# Altium schematic sheet CCD.SchDoc
size A4; SheetNumber: 4; SheetTotal: 5
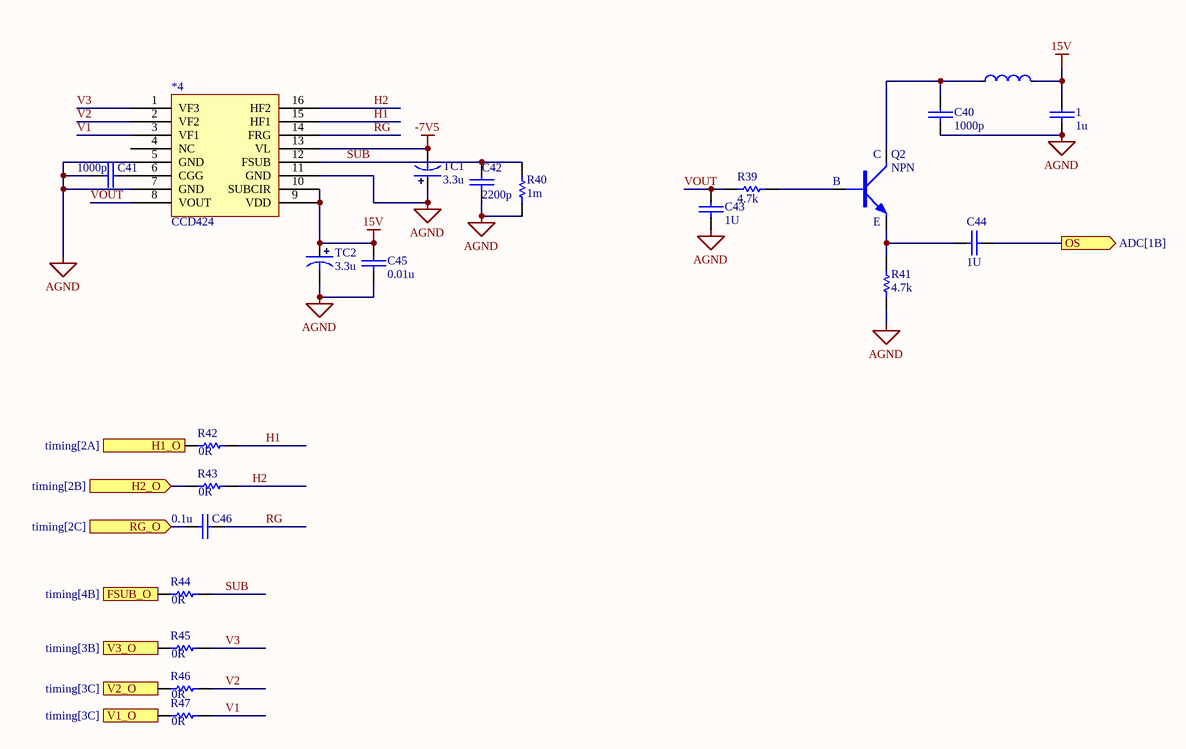
[diagram p0: CCD.SchDoc]

## Parts
1  1u  [0603C]
*4  CCD424  [CCD424]
C40  1000p  [0603C]
C41  1000p  [0603C]
C42  2200p  [0603C]
C43  1U  [0603C]
C44  1U  [0603C]
C45  0.01u  [0603C]
C46  0.1u  [0603C]
L11  GZ1608D601TF  [0603L]  (value not drawn)
Q2  NPN  [SOT23-3]
R39  4.7k  [0603R]
R40  1m  [0603R]
R41  4.7k  [0603R]
R42  0R  [0603R]
R43  0R  [0603R]
R44  0R  [0603R]
R45  0R  [0603R]
R46  0R  [0603R]
R47  0R  [0603R]
TC1  3.3u  [TAJ-A/3216]
TC2  3.3u  [TAJ-A/3216]

## Ports
FSUB_O (in, see timing[4B]), H1_O (in, see timing[2A]), H2_O (in, see timing[2B]), OS (out, see ADC[1B]), RG_O (in, see timing[2C]), V1_O (in, see timing[3C]), V2_O (in, see timing[3C]), V3_O (in, see timing[3B])

## Nets
15V: 1.2 *4.9(VDD) *4.10(SUBCIR) C45.2 L11.2 TC2.1
-7V5: *4.13(VL) TC1.2
AGND: 1.1 *4.5(GND) *4.7(GND) *4.11(GND) C40.1 C41.2 C42.1 C43.2 C45.1 R40.1 R41.1 TC1.1 TC2.2
FSUB_O: R44.2 ; port FSUB_O
H1: *4.15(HF1) R42.1
H1_O: R42.2 ; port H1_O
H2: *4.16(HF2) R43.1
H2_O: R43.2 ; port H2_O
OS: C44.1 ; port OS
RG: *4.14(FRG) C46.1
RG_O: C46.2 ; port RG_O
SUB: *4.12(FSUB) C42.2 R40.2 R44.1
V1: *4.3(VF1) R47.1
V1_O: R47.2 ; port V1_O
V2: *4.2(VF2) R46.1
V2_O: R46.2 ; port V2_O
V3: *4.1(VF3) R45.1
V3_O: R45.2 ; port V3_O
VOUT: *4.8(VOUT) C43.1 R39.2
Net*4_6: *4.6(CGG) C41.1
NetC40_2: C40.2 L11.1 Q2.3(C)
NetC44_2: C44.2 Q2.2(E) R41.2
NetQ2_1: Q2.1(B) R39.1

Not connected (* = marked no-connect by the designer): *4 4(NC)

## Library data of the parts
1 C40-C46 = CAP: 无极性电容
L11 = FB: 铁氧体磁珠; Manufacturer: Sunlord(顺络); Add into BOM: yes; Impedance @ Frequency: 600Ω@100MHz; Tolerance: ±25%; DC Resistance: 450mΩ; Current Rating: 200mA; Circuits: 1; Name: GZ1608D601TF; Symbol: GZ1608D601TF; Device: GZ1608D601TF; LCSC Part Name: 600Ω@100MHz ±25%; Supplier Part: C1002; Manufacturer Part: GZ1608D601TF; Supplier Footprint: 0603; JLCPCB Part Class: Basic Part; Datasheet: https://atta.szlcsc.com/upload/public/pdf/source/20210830/355EA7C0FAC5394FC0FE3F17C770C20A.pdf; Supplier: LCSC; Convert to PCB: yes
Q2 = NPN: NPN三极管
R39-R47 = RES: 电阻
TC1 TC2 = TCAP: 钽电容